# EAGLE design board (EAGLE 5.06)
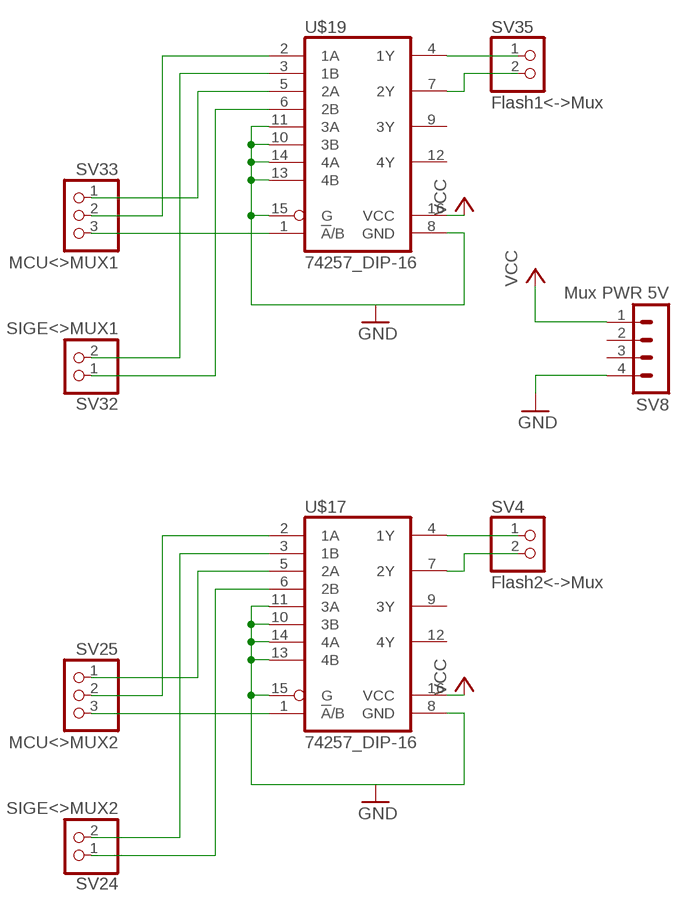
[diagram p0: schematic, sheet 1]

## Parts
SV4  Flash2<->Mux  PINHD-1X2  [1X02]
SV8  Mux PWR 5V  MA04-1  [MA04-1]
SV24  SIGE<>MUX2  PINHD-1X2  [1X02]
SV25  MCU<>MUX2  PINHD-1X3  [1X03]
SV32  SIGE<>MUX1  PINHD-1X2  [1X02]
SV33  MCU<>MUX1  PINHD-1X3  [1X03]
SV35  Flash1<->Mux  PINHD-1X2  [1X02]
U$17  74257_DIP-16  [DIL16]
U$19  74257_DIP-16  [DIL16]

## Nets
GND: SV8.4 U$17.8(GND) U$17.10(3B) U$17.11(3A) U$17.13(4B) U$17.14(4A) U$17.15(G) U$19.8(GND) U$19.10(3B) U$19.11(3A) U$19.13(4B) U$19.14(4A) U$19.15(G)
N$1: SV25.3 U$17.1(!A!/B)
N$73: SV25.2 U$17.2(1A)
N$75: SV25.1 U$17.5(2A)
N$76: SV24.2 U$17.3(1B)
N$77: SV24.1 U$17.6(2B)
N$90: SV4.1 U$17.4(1Y)
N$92: SV4.2 U$17.7(2Y)
N$93: SV33.2 U$19.2(1A)
N$94: SV33.1 U$19.5(2A)
N$95: SV32.2 U$19.3(1B)
N$96: SV32.1 U$19.6(2B)
N$101: SV33.3 U$19.1(!A!/B)
N$102: SV35.1 U$19.4(1Y)
N$103: SV35.2 U$19.7(2Y)
VCC: SV8.1 U$17.16(VCC) U$19.16(VCC)
Unconnected: SV8.2 SV8.3 U$17.9(3Y) U$17.12(4Y) U$19.9(3Y) U$19.12(4Y)

## Library data of the parts
SV4 SV24 SV32 SV35 = pinhead:PINHD-1X2: PIN HEADER
SV8 = con-lstb:MA04-1: PIN HEADER
SV25 SV33 = pinhead:PINHD-1X3: PIN HEADER
U$17 U$19 = mylib:74257_DIP-16

## Board
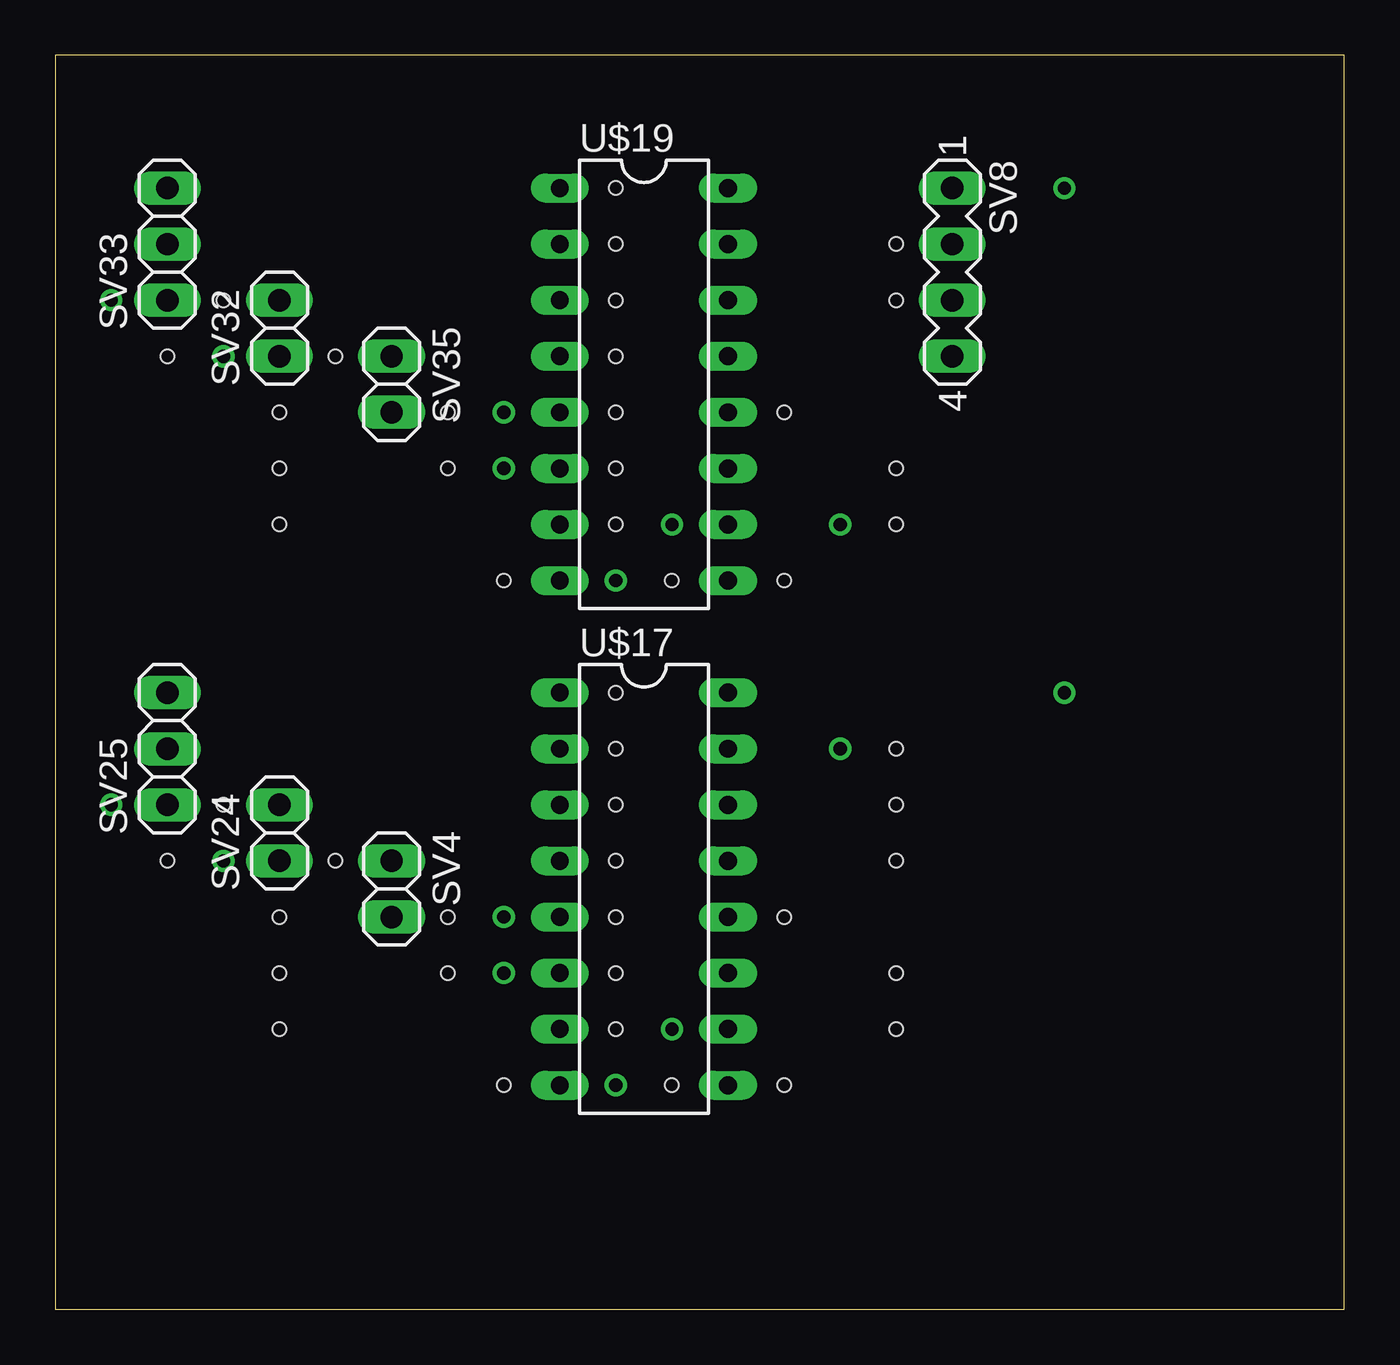
[diagram p1: board, top side]
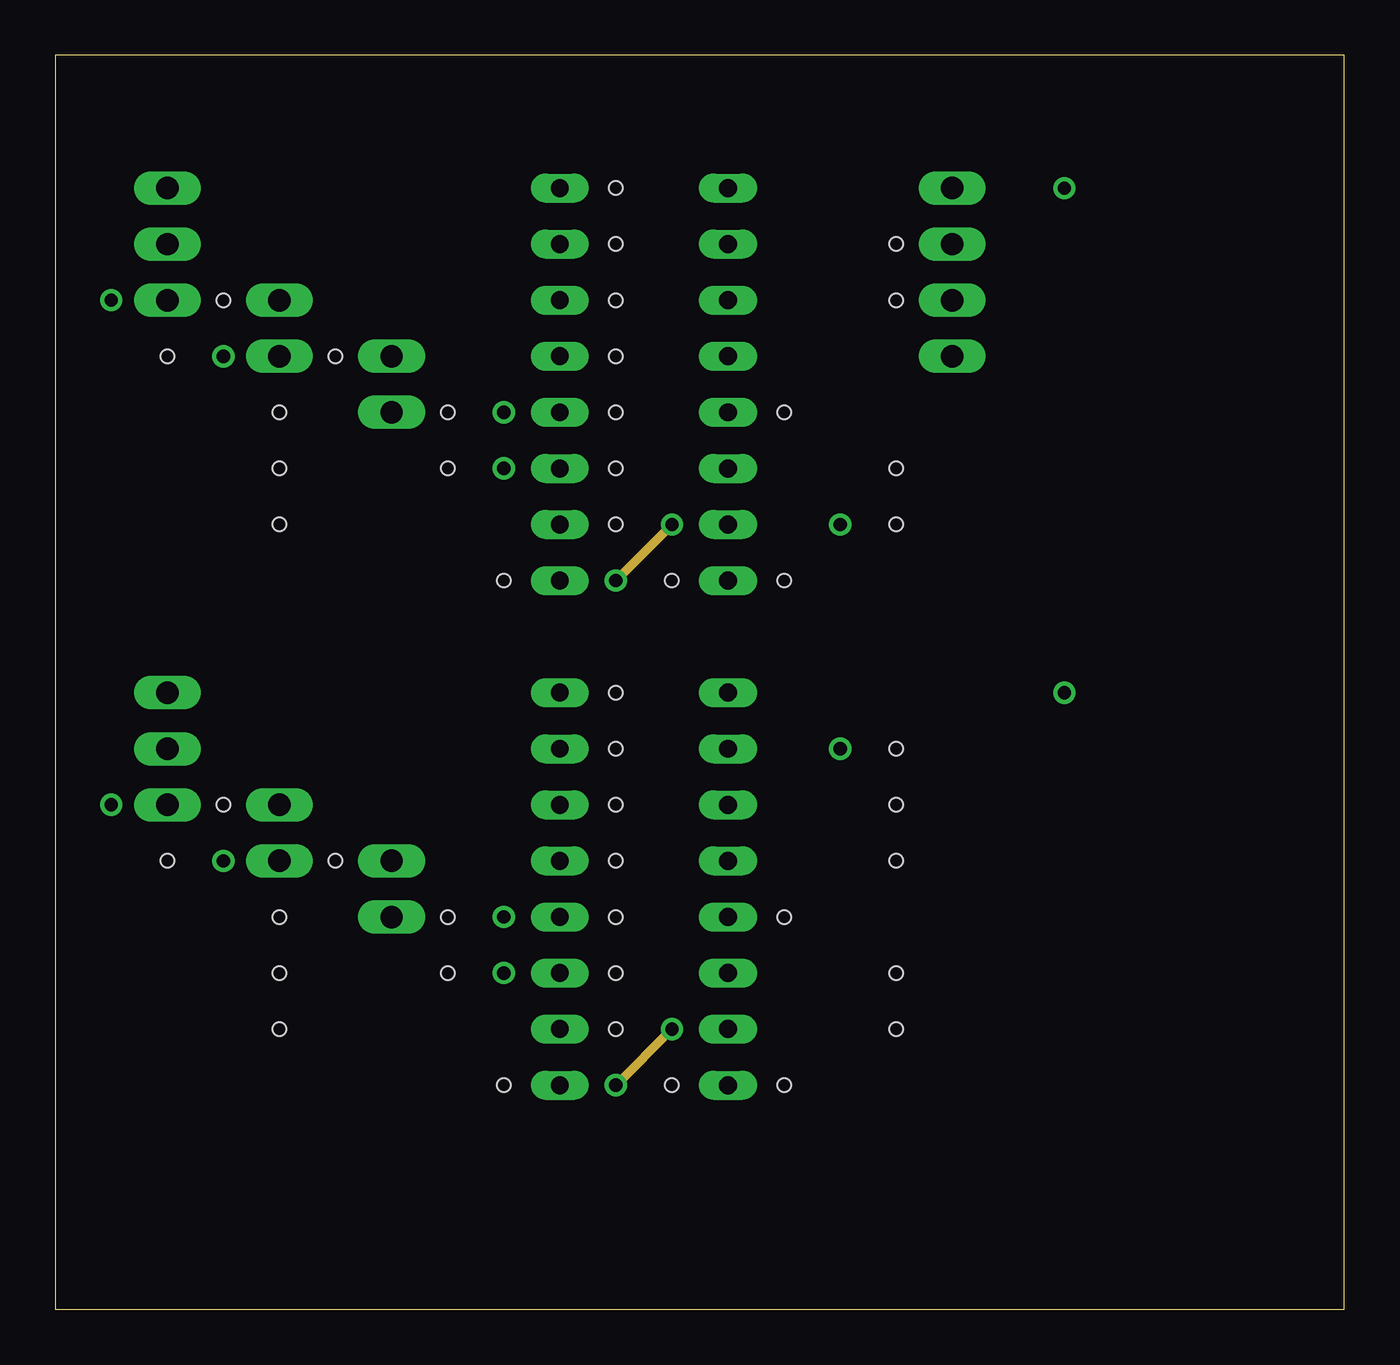
[diagram p2: board, inner layer Route2]
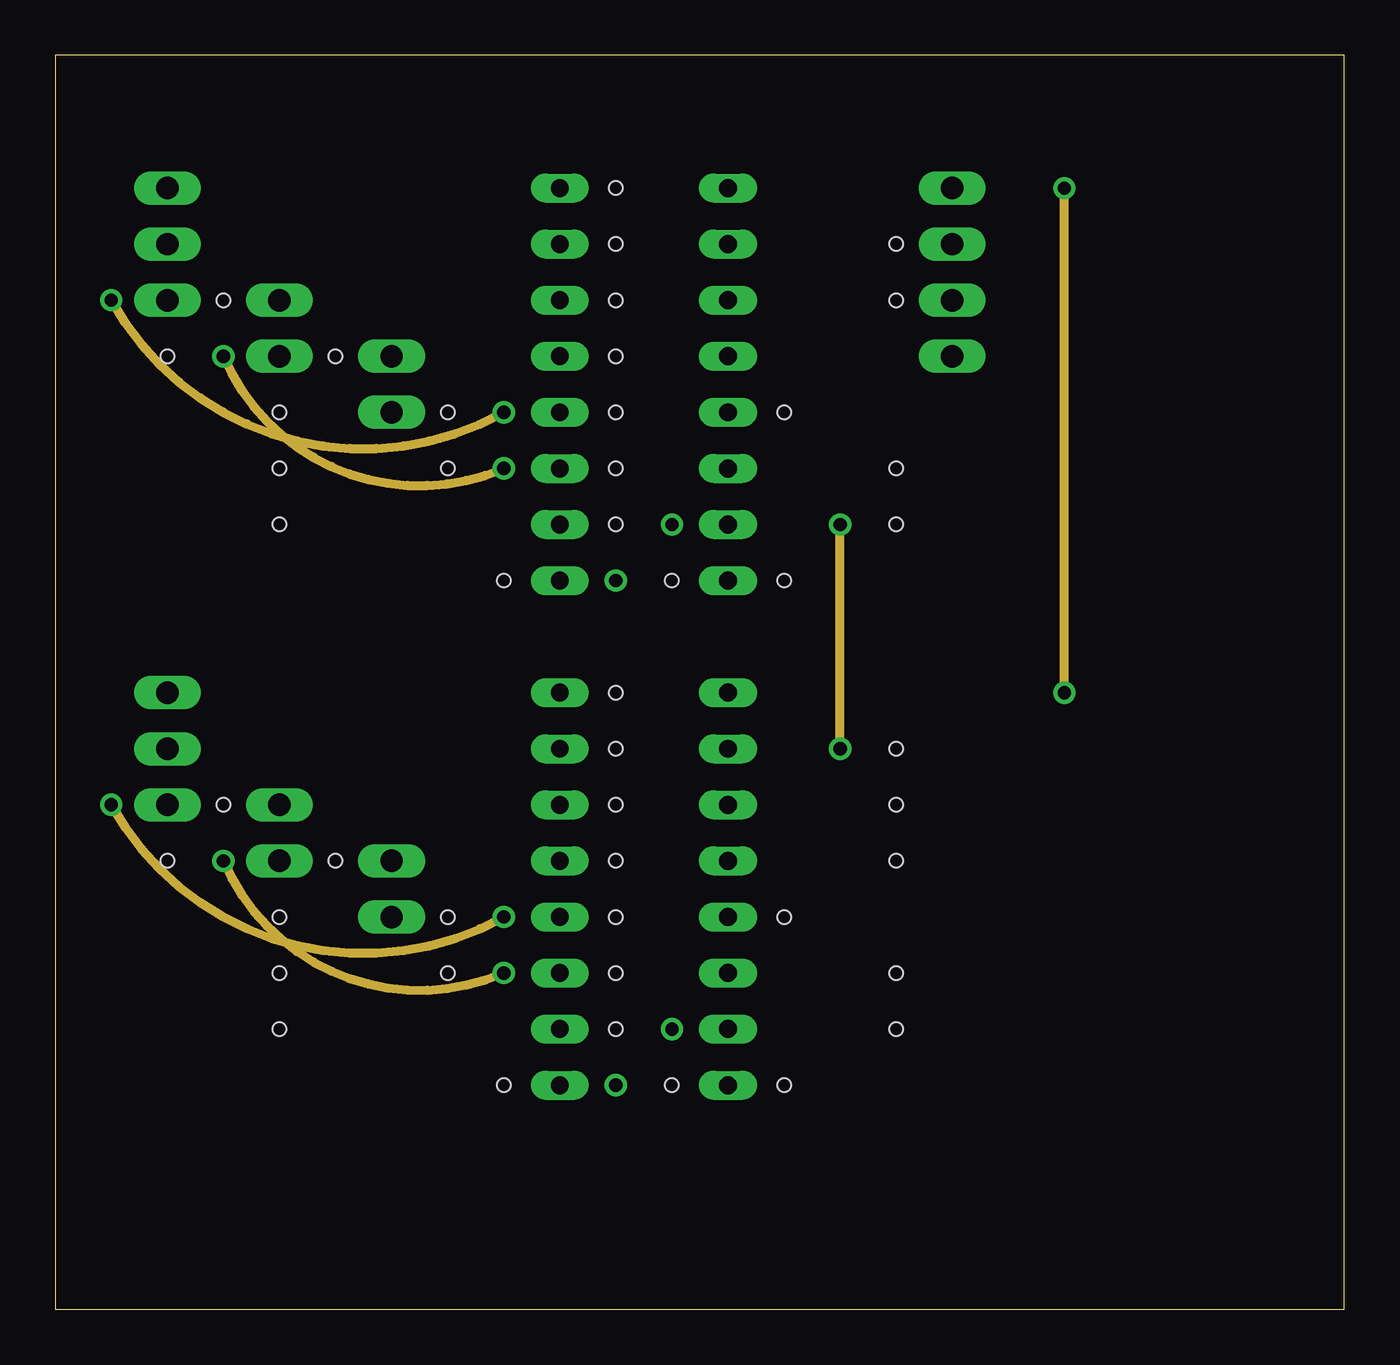
[diagram p3: board, inner layer Route15]
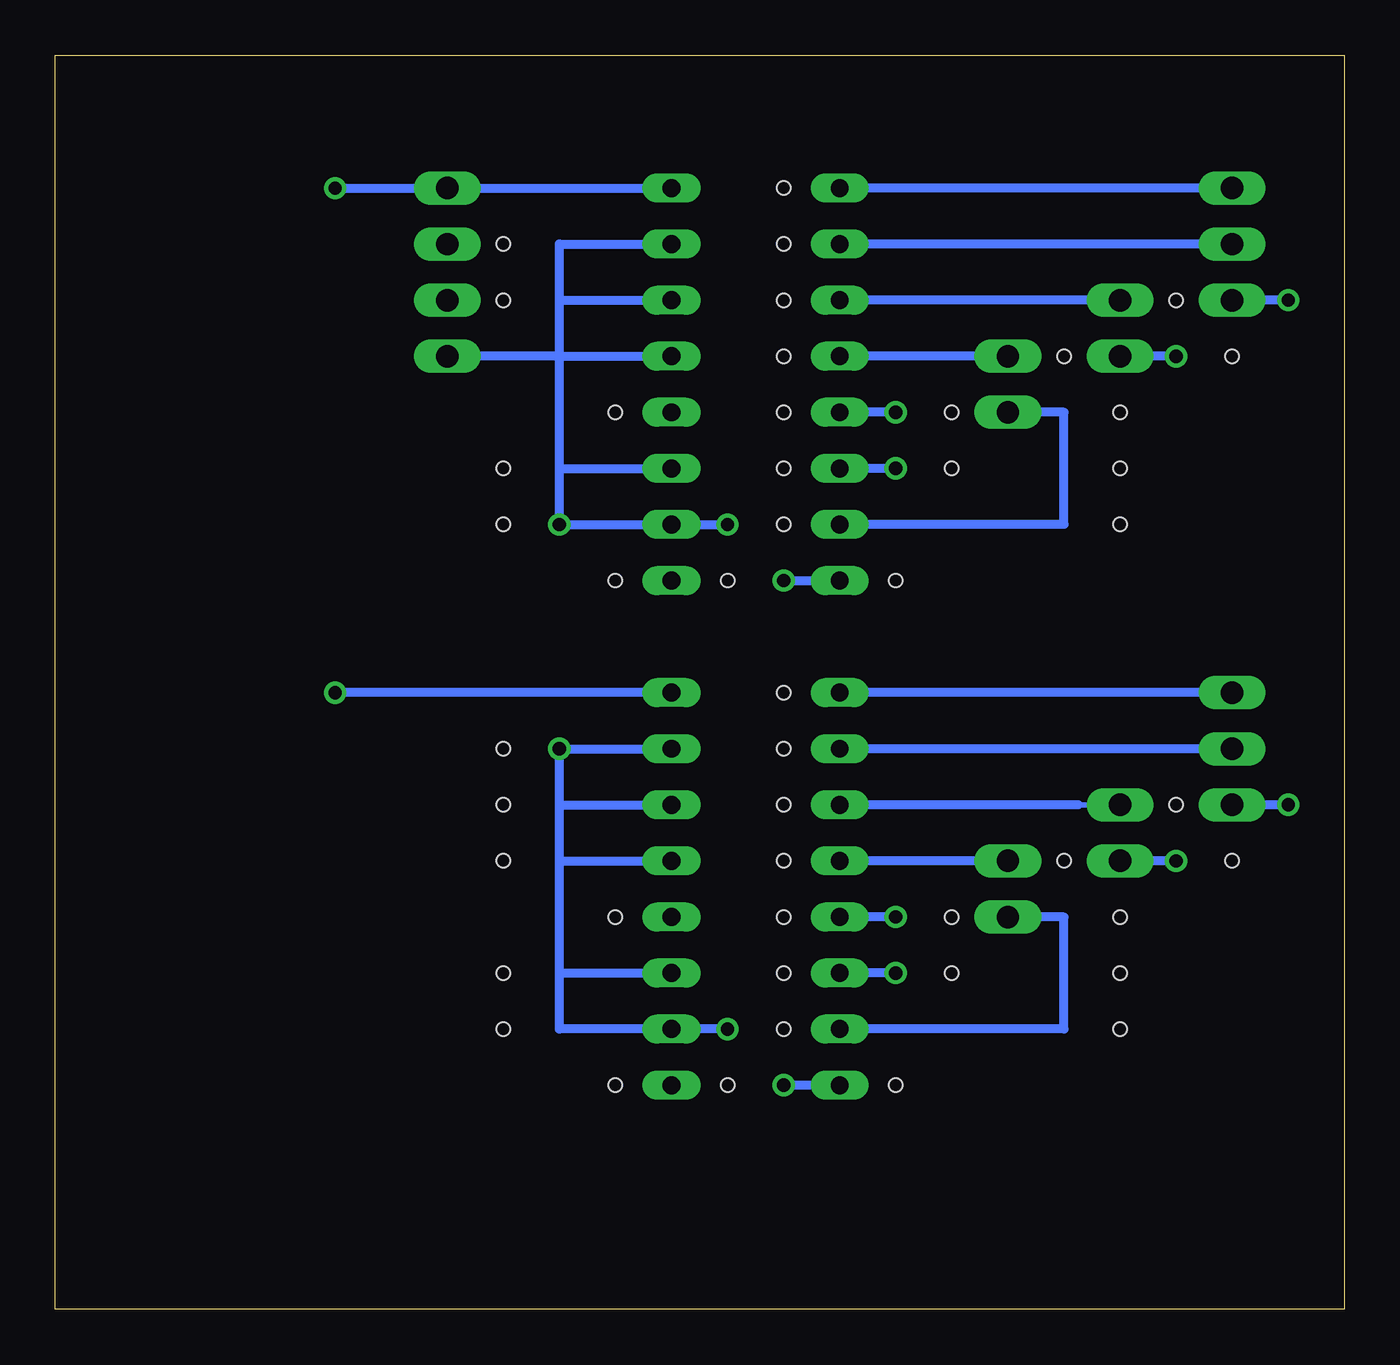
[diagram p4: board, bottom side, seen from below]

Size 58.4 x 56.82 mm. Coordinates in mm from the lower left corner, seen from the top.
Outline: 0,0 58.4,0 58.4,56.82 0,56.82 0,0
Copper layers (1*2*15*16): Top 0.035mm / dielectric 1.5mm / Route2 0.035mm / dielectric 0.15mm / Route15 0.035mm / dielectric 0.2mm / Bottom 0.035mm
Design rules "default *": minimum track width 10mil, minimum drill 24mil, track to track 8mil, track to pad 8mil, pad to pad 8mil, via to via 8mil, smd to smd 8mil, copper to edge 40mil, drill to drill 8mil, minimum pad ring 10mil, minimum via ring 8mil, stop-mask expansion 4mil, vias tented up to drill 0mil, thermal gap 10mil
Holes 0.6 mm at 33.02,40.64 33.02,17.78 33.02,10.16 27.94,33.02 25.4,35.56 27.94,10.16 25.4,12.7 38.1,48.26 38.1,45.72 38.1,25.4 38.1,22.86 38.1,20.32 38.1,15.24 38.1,12.7 38.1,38.1 38.1,35.56 33.02,33.02 17.78,40.64 12.7,43.18 5.08,43.18 5.08,20.32 12.7,20.32 17.78,17.78 17.78,15.24 17.78,38.1 20.32,10.16 20.32,33.02 10.16,17.78 10.16,15.24 10.16,12.7 10.16,40.64 10.16,38.1 10.16,35.56 25.4,27.94 25.4,25.4 25.4,22.86 25.4,20.32 25.4,17.78 25.4,15.24 25.4,50.8 25.4,48.26 25.4,45.72 25.4,43.18 25.4,40.64 25.4,38.1 7.62,45.72 7.62,22.86

### Footprints (pad centres in the part's own frame; a part is rotated, then mirrored left to right if it is on the bottom)
1X02 = drill 1.016 long: 1 -1.27,0; 2 1.27,0
MA04-1 = drill 1.016 long: 1 -3.81,0; 2 -1.27,0; 3 1.27,0; 4 3.81,0
1X03 = drill 1.016 long: 1 -2.54,0; 2 0,0; 3 2.54,0
DIL16 = drill 0.813 long: 1 -8.89,-3.81; 2 -6.35,-3.81; 3 -3.81,-3.81; 4 -1.27,-3.81; 5 1.27,-3.81; 6 3.81,-3.81; 7 6.35,-3.81; 8 8.89,-3.81; 9 8.89,3.81; 10 6.35,3.81; 11 3.81,3.81; 12 1.27,3.81; 13 -1.27,3.81; 14 -3.81,3.81; 15 -6.35,3.81; 16 -8.89,3.81

### Placement (x,y rotation side)
SV4  15.24,19.05 270 top
SV8  40.64,46.99 270 top
SV24  10.16,21.59 90 top
SV25  5.08,25.4 90 top
SV32  10.16,44.45 90 top
SV33  5.08,48.26 90 top
SV35  15.24,41.91 270 top
U$17  26.67,19.05 270 top
U$19  26.67,41.91 270 top

### Tracks (layer width: path | path; a pad name or v marks a point on that pad's centre or on a via)
GND  (via drill 0.6)
  Route2 0.406: v25.4,10.16 v27.94,12.7 | v27.94,35.56 v25.4,33.02
  Route15 0.406: v35.56,25.4 v35.56,35.56
  Bottom 0.406: 35.56,43.18 U$19.13 | 35.56,43.18 SV8.4 | U$17.8 v25.4,10.16 | v27.94,12.7 U$17.10 35.56,12.7 35.56,15.24 | 35.56,20.32 U$17.13 | 35.56,15.24 35.56,20.32 | 35.56,15.24 U$17.11 | v25.4,33.02 U$19.8 | v27.94,35.56 U$19.10 v35.56,35.56 35.56,38.1 | 35.56,38.1 35.56,43.18 | 35.56,38.1 U$19.11 | 35.56,20.32 35.56,22.86 | 35.56,22.86 v35.56,25.4 U$17.15 | 35.56,22.86 U$17.14 | 35.56,43.18 35.56,45.72 | 35.56,45.72 35.56,48.26 U$19.15 | 35.56,45.72 U$19.14
N$1
  Bottom 0.406: SV25.3 U$17.1
N$73
  Bottom 0.406: SV25.2 U$17.2
N$75  (via drill 0.6)
  Route15 0.406: v2.54,22.86 arc90 v20.32,17.78
  Bottom 0.406: v2.54,22.86 SV25.1 | v20.32,17.78 U$17.5
N$76
  Bottom 0.254: SV24.2 12.06,22.86
  Bottom 0.406: 12.06,22.86 U$17.3
N$77  (via drill 0.6)
  Route15 0.406: v7.62,20.32 arc90 v20.32,15.24
  Bottom 0.406: v7.62,20.32 SV24.1 | v20.32,15.24 U$17.6
N$90
  Bottom 0.406: SV4.1 U$17.4
N$92
  Bottom 0.406: SV4.2 12.7,17.78 12.7,12.7 U$17.7
N$93
  Bottom 0.406: SV33.2 U$19.2
N$94  (via drill 0.6)
  Route15 0.406: v2.54,45.72 arc90 v20.32,40.64
  Bottom 0.406: v2.54,45.72 SV33.1 | v20.32,40.64 U$19.5
N$95
  Bottom 0.406: SV32.2 U$19.3
N$96  (via drill 0.6)
  Route15 0.406: v7.62,43.18 arc90 v20.32,38.1
  Bottom 0.406: v7.62,43.18 SV32.1 | v20.32,38.1 U$19.6
N$101
  Bottom 0.406: SV33.3 U$19.1
N$102
  Bottom 0.406: SV35.1 U$19.4
N$103
  Bottom 0.406: U$19.7 12.7,35.56 12.7,40.64 SV35.2
VCC  (via drill 0.6)
  Route15 0.406: v45.72,27.94 v45.72,50.8
  Bottom 0.406: U$19.16 SV8.1 v45.72,50.8 | U$17.16 v45.72,27.94